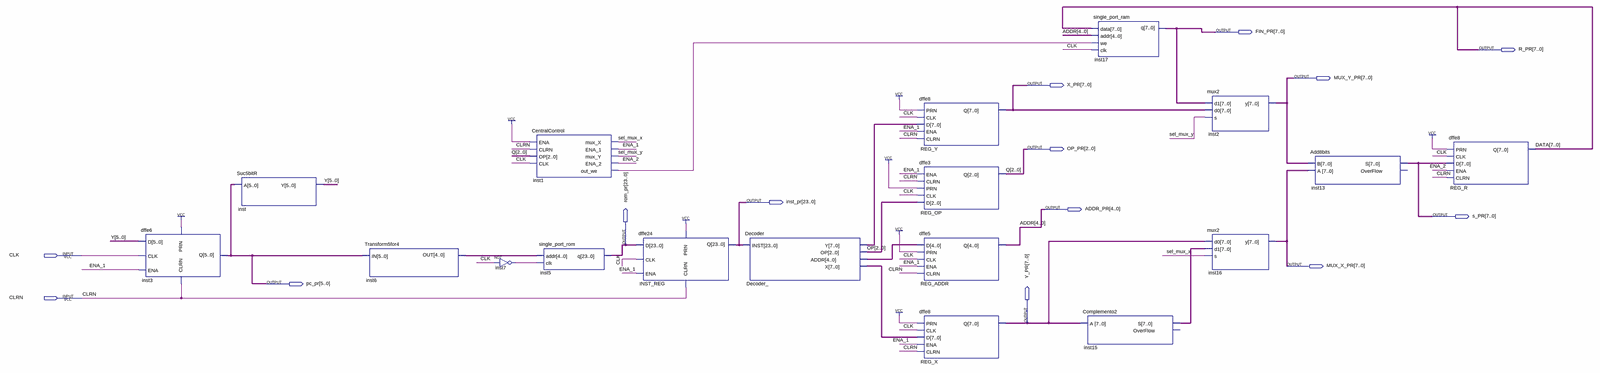
[diagram p0: schematic sheet, whole]
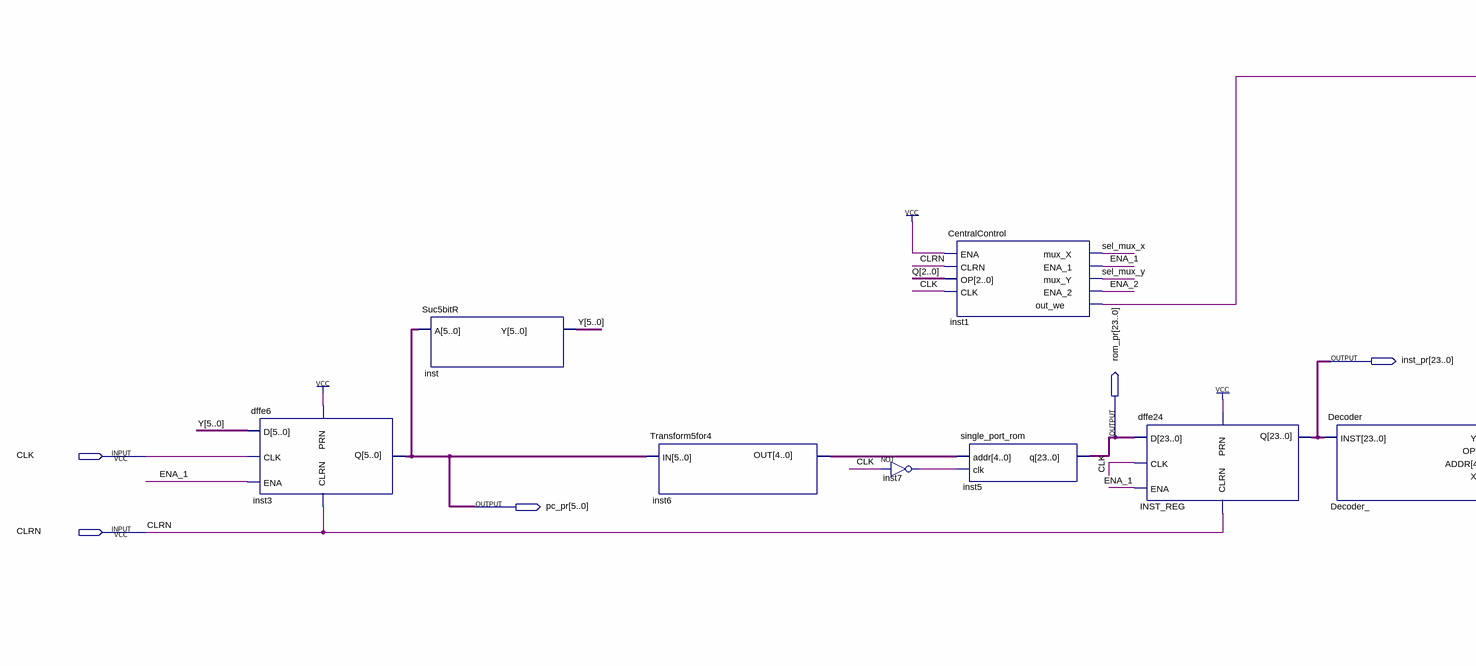
[diagram p1: schematic sheet, left part]
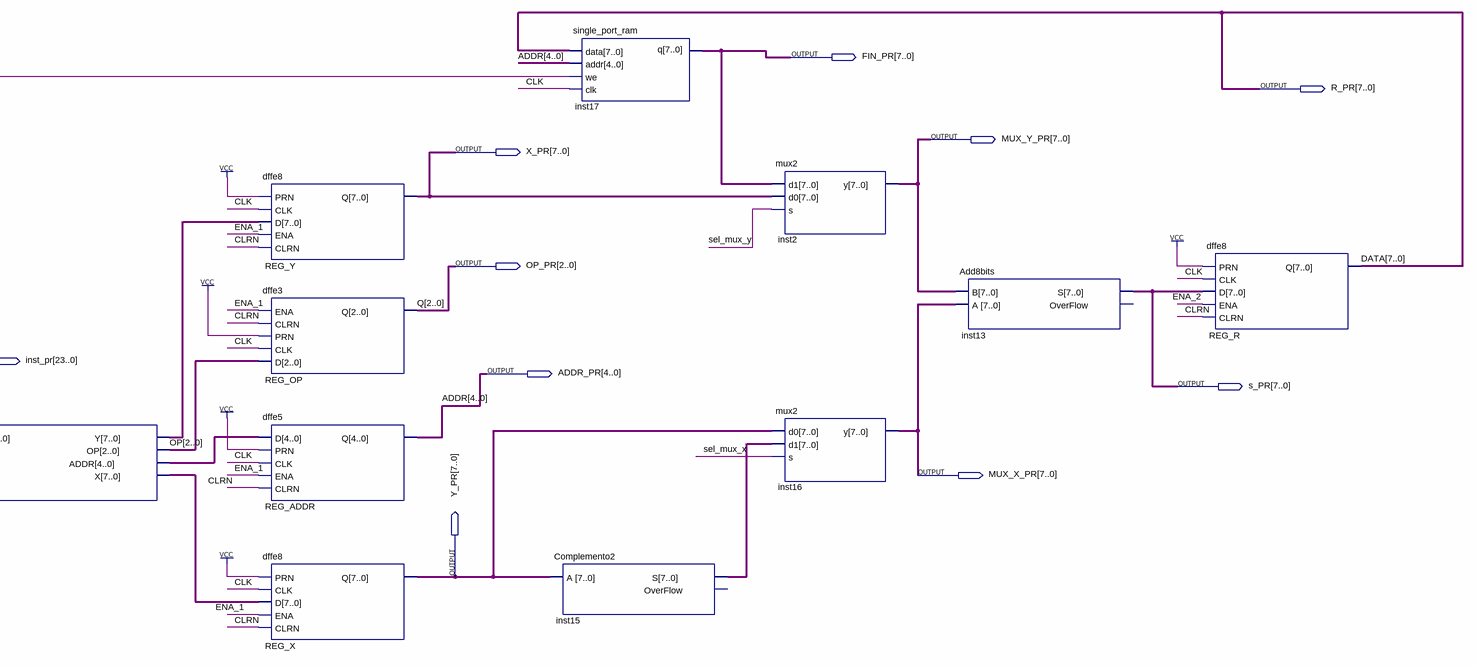
[diagram p2: schematic sheet, right part]
// Quartus schematic Main.bdf as structural Verilog: 18 symbols, 14 pins
module Main (
  input  CLK,
  input  CLRN,
  output [7:0] FIN_PR,
  output [7:0] R_PR,
  output [7:0] MUX_Y_PR,
  output [7:0] X_PR,
  output [2:0] OP_PR,
  output [23:0] inst_pr,
  output [4:0] ADDR_PR,
  output [7:0] s_PR,
  output [23:0] rom_pr,
  output [7:0] MUX_X_PR,
  output [5:0] pc_pr,
  output [7:0] Y_PR
);

  wire ENA_1, ENA_2, inst1_out_we, inst7_out, sel_mux_x, sel_mux_y;
  wire [2:0] OP;
  wire [4:0] Decoder__addr, inst6_out;
  wire [5:0] Y;
  wire [7:0] Decoder__x, Decoder__y, inst15_s;

  dffe6 inst3 (.CLK(CLK), .ENA(ENA_1), .PRN(1'b1), .CLRN(CLRN), .D(Y), .Q(pc_pr));
  Suc5bitR inst (.A(pc_pr), .Y(Y));
  Transform5for4 inst6 (.IN(pc_pr), .OUT(inst6_out));
  not inst7 (inst7_out, CLK);
  CentralControl inst1 (
    .ENA(1'b1), .CLRN(CLRN), .OP(OP_PR), .CLK(CLK), .mux_X(sel_mux_x), .ENA_1(ENA_1), .mux_Y(sel_mux_y),
    .ENA_2(ENA_2), .out_we(inst1_out_we));
  single_port_rom inst5 (.addr(inst6_out), .clk(inst7_out), .q(rom_pr));
  dffe24 INST_REG (.CLK(CLK), .ENA(ENA_1), .D(rom_pr), .PRN(1'b1), .CLRN(CLRN), .Q(inst_pr));
  Decoder Decoder_ (.INST(inst_pr), .Y(Decoder__y), .OP(OP), .ADDR(Decoder__addr), .X(Decoder__x));
  dffe8 REG_Y (.PRN(1'b1), .CLK(CLK), .D(Decoder__y), .ENA(ENA_1), .CLRN(CLRN), .Q(X_PR));
  dffe3 REG_OP (.ENA(ENA_1), .CLRN(CLRN), .PRN(1'b1), .CLK(CLK), .D(OP), .Q(OP_PR));
  dffe5 REG_ADDR (.D(Decoder__addr), .PRN(1'b1), .CLK(CLK), .ENA(ENA_1), .CLRN(CLRN), .Q(ADDR_PR));
  dffe8 REG_X (.PRN(1'b1), .CLK(CLK), .D(Decoder__x), .ENA(ENA_1), .CLRN(CLRN), .Q(Y_PR));
  single_port_ram inst17 (.data(R_PR), .addr(ADDR_PR), .we(inst1_out_we), .clk(CLK), .q(FIN_PR));
  Complemento2 inst15 (.A(Y_PR), .S(inst15_s));  // open: OverFlow
  mux2 inst2 (.d0(X_PR), .d1(FIN_PR), .s(sel_mux_y), .y(MUX_Y_PR));
  mux2 inst16 (.d0(Y_PR), .d1(inst15_s), .s(sel_mux_x), .y(MUX_X_PR));
  Add8bits inst13 (.B(MUX_Y_PR), .A(MUX_X_PR), .S(s_PR));  // open: OverFlow
  dffe8 REG_R (.PRN(1'b1), .CLK(CLK), .D(s_PR), .ENA(ENA_2), .CLRN(CLRN), .Q(R_PR));

  // Other names for the same wires on the sheet: ADDR[4:0] = ADDR_PR; Q[2:0] = OP_PR; DATA[7:0] = R_PR
endmodule
